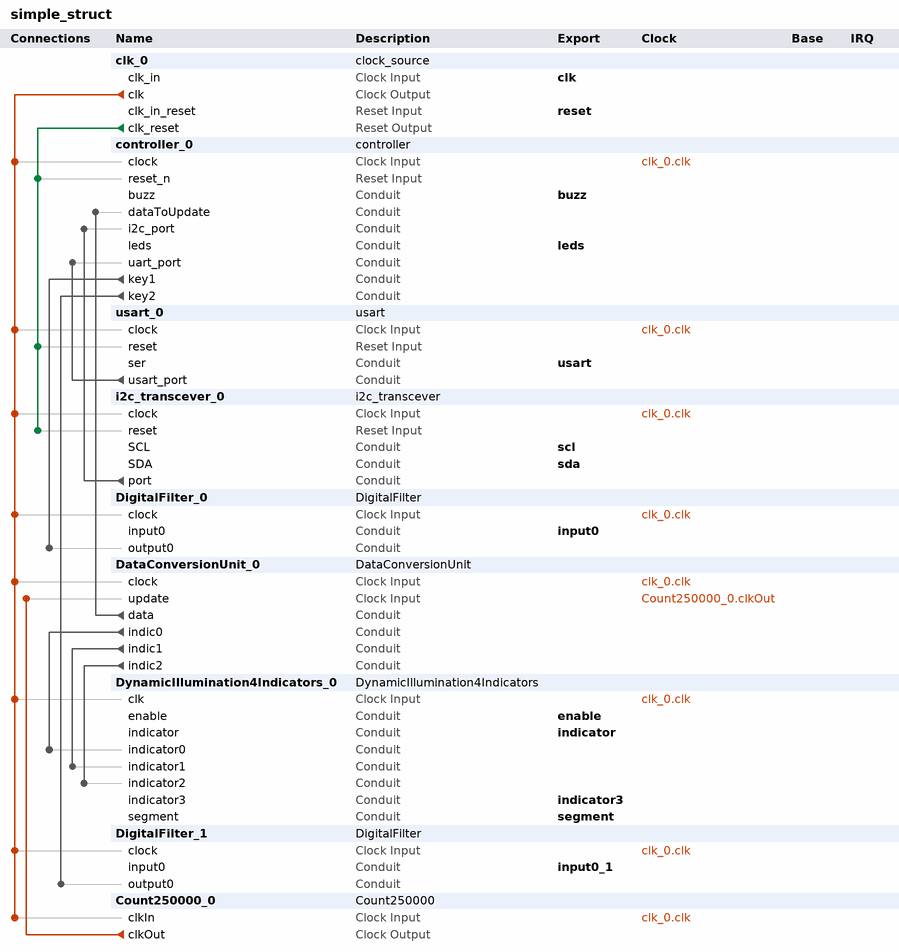
[diagram p0: system contents]
# Platform Designer (Qsys) system simple_struct, Cyclone IV E EP4CE6E22C8
# Parameters at their usual value, and those the tool derives, are not listed.
package require -exact qsys 22.1
create_system simple_struct
set_project_property DEVICE_FAMILY {Cyclone IV E}
set_project_property DEVICE EP4CE6E22C8

add_instance clk_0 clock_source 22.1
set_instance_parameter_value clk_0 clockFrequency 50000000

add_instance controller_0 controller 1.0

add_instance usart_0 usart 1.0
set_instance_parameter_value usart_0 BAUD_RATE 9600
set_instance_parameter_value usart_0 CLK_FREQ_HZ 50000000
set_instance_parameter_value usart_0 DATA_BITS 8
set_instance_parameter_value usart_0 PARITY 0
set_instance_parameter_value usart_0 STOP_BITS 1

add_instance i2c_transcever_0 i2c_transcever 1.0
set_instance_parameter_value i2c_transcever_0 bus_clk 100000
set_instance_parameter_value i2c_transcever_0 input_clk 50000000

add_instance DigitalFilter_0 DigitalFilter 1.0
set_instance_parameter_value DigitalFilter_0 PHASE_SHIFT 200

add_instance DataConversionUnit_0 DataConversionUnit 1.0

add_instance DynamicIllumination4Indicators_0 DynamicIllumination4Indicators 1.0

add_instance DigitalFilter_1 DigitalFilter 1.0
set_instance_parameter_value DigitalFilter_1 PHASE_SHIFT 2000

add_instance Count250000_0 Count250000 1.0

# connections
add_connection clk_0.clk controller_0.clock clock
add_connection clk_0.clk Count250000_0.clkIn clock
add_connection clk_0.clk DataConversionUnit_0.clock clock
add_connection clk_0.clk DigitalFilter_0.clock clock
add_connection clk_0.clk DigitalFilter_1.clock clock
add_connection clk_0.clk DynamicIllumination4Indicators_0.clk clock
add_connection clk_0.clk i2c_transcever_0.clock clock
add_connection clk_0.clk usart_0.clock clock
add_connection Count250000_0.clkOut DataConversionUnit_0.update clock
add_connection clk_0.clk_reset controller_0.reset_n reset
add_connection clk_0.clk_reset i2c_transcever_0.reset reset
add_connection clk_0.clk_reset usart_0.reset reset
add_connection controller_0.key1 DigitalFilter_0.output0 conduit
add_connection controller_0.key2 DigitalFilter_1.output0 conduit
add_connection DataConversionUnit_0.data controller_0.dataToUpdate conduit
add_connection DataConversionUnit_0.indic0 DynamicIllumination4Indicators_0.indicator0 conduit
add_connection DataConversionUnit_0.indic1 DynamicIllumination4Indicators_0.indicator1 conduit
add_connection DataConversionUnit_0.indic2 DynamicIllumination4Indicators_0.indicator2 conduit
add_connection i2c_transcever_0.port controller_0.i2c_port conduit
add_connection usart_0.usart_port controller_0.uart_port conduit

# exported interfaces
add_interface buzz conduit end
set_interface_property buzz EXPORT_OF controller_0.buzz
add_interface clk clock sink
set_interface_property clk EXPORT_OF clk_0.clk_in
add_interface enable conduit end
set_interface_property enable EXPORT_OF DynamicIllumination4Indicators_0.enable
add_interface indicator conduit end
set_interface_property indicator EXPORT_OF DynamicIllumination4Indicators_0.indicator
add_interface indicator3 conduit end
set_interface_property indicator3 EXPORT_OF DynamicIllumination4Indicators_0.indicator3
add_interface input0 conduit end
set_interface_property input0 EXPORT_OF DigitalFilter_0.input0
add_interface input0_1 conduit end
set_interface_property input0_1 EXPORT_OF DigitalFilter_1.input0
add_interface leds conduit end
set_interface_property leds EXPORT_OF controller_0.leds
add_interface reset reset sink
set_interface_property reset EXPORT_OF clk_0.clk_in_reset
add_interface scl conduit end
set_interface_property scl EXPORT_OF i2c_transcever_0.SCL
add_interface sda conduit end
set_interface_property sda EXPORT_OF i2c_transcever_0.SDA
add_interface segment conduit end
set_interface_property segment EXPORT_OF DynamicIllumination4Indicators_0.segment
add_interface usart conduit end
set_interface_property usart EXPORT_OF usart_0.ser

set_interconnect_requirement {$system} qsys_mm.clockCrossingAdapter HANDSHAKE
set_interconnect_requirement {$system} qsys_mm.enableEccProtection FALSE
set_interconnect_requirement {$system} qsys_mm.insertDefaultSlave FALSE
set_interconnect_requirement {$system} qsys_mm.maxAdditionalLatency 1

save_system simple_struct.qsys
